# Altium schematic sheet TopLevel.SchDoc
size A4; SheetNumber: 1; SheetTotal: 2
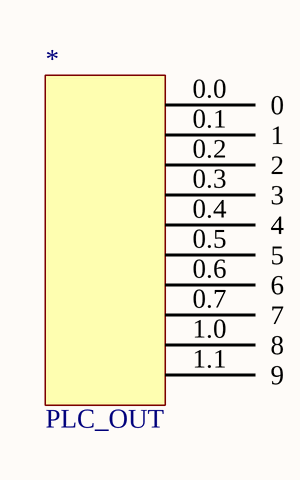
[diagram p0: TopLevel.SchDoc]

## Parts
*  PLC_OUT

## Nets

Not connected (* = marked no-connect by the designer): * 0.0(0) 0.1(1) 0.2(2) 0.3(3) 0.4(4) 0.5(5) 0.6(6) 0.7(7) 1.0(8) 1.1(9)